# EAGLE design untitled (EAGLE 6.1)
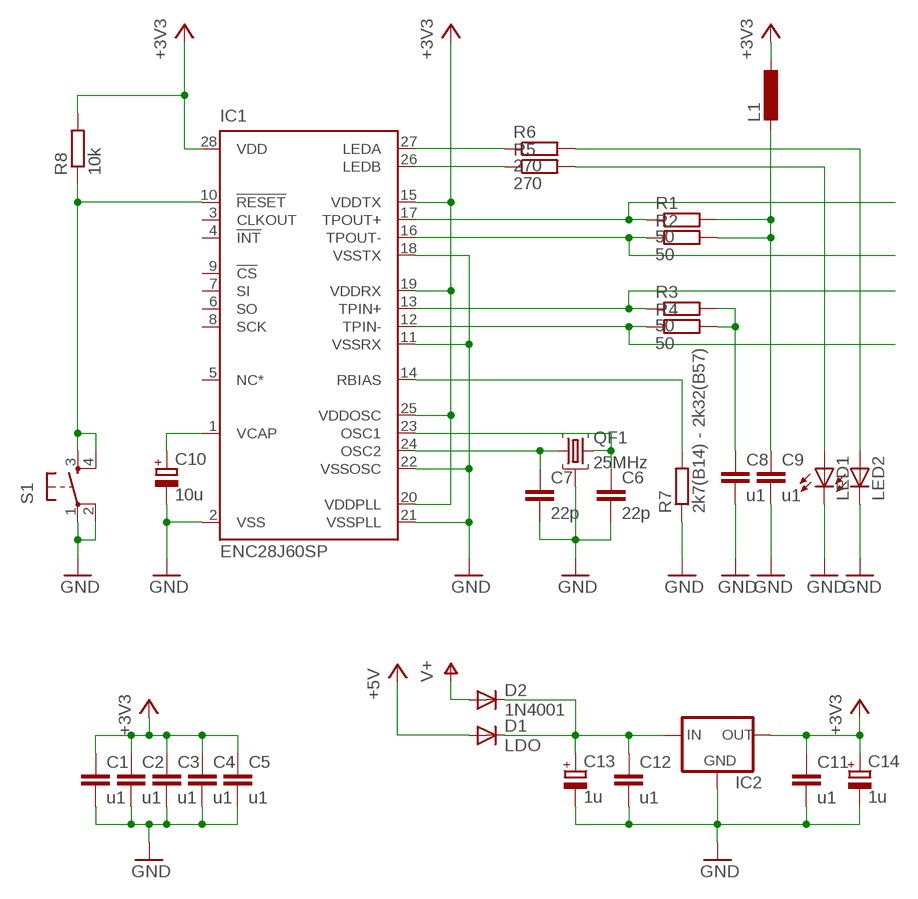
[diagram p0: schematic, sheet 1]

## Parts
C1  u1  C-EU025-025X050  [C025-025X050]
C2  u1  C-EU025-025X050  [C025-025X050]
C3  u1  C-EU025-025X050  [C025-025X050]
C4  u1  C-EU025-025X050  [C025-025X050]
C5  u1  C-EU025-025X050  [C025-025X050]
C6  22p  C-EU025-025X050  [C025-025X050]
C7  22p  C-EU025-025X050  [C025-025X050]
C8  u1  C-EU025-025X050  [C025-025X050]
C9  u1  C-EU025-025X050  [C025-025X050]
C10  10u  CPOL-EUE2.5-6  [E2,5-6]
C11  u1  C-EU025-025X050  [C025-025X050]
C12  u1  C-EU025-025X050  [C025-025X050]
C13  1u  CPOL-EUE2.5-6  [E2,5-6]
C14  1u  CPOL-EUE2.5-6  [E2,5-6]
D1  LDO  DIODE-D-2.5  [D-2.5]
D2  1N4001  DIODE-D-2.5  [D-2.5]
IC1  ENC28J60SP  [DIL28-3]
IC2  MCP1700_TO92-INLINE  [TO92-]
L1  L-EU0204/5  [0204/5]
LED1  LED5MM  [LED5MM]
LED2  LED5MM  [LED5MM]
QF1  25MHz  8M10AHC49T  [HC49U]
R1  50  R-EU_0204/7  [0204/7]
R2  50  R-EU_0204/7  [0204/7]
R3  50  R-EU_0204/7  [0204/7]
R4  50  R-EU_0204/7  [0204/7]
R5  270  R-EU_0204/7  [0204/7]
R6  270  R-EU_0204/7  [0204/7]
R7  2k7(B14) - 2k32(B57)  R-EU_0204/7  [0204/7]
R8  10k  R-EU_0204/2V  [0204V]
S1  TAC_SWITCHPTH  [TACTILE-PTH]

## Nets
+3V3: C1.1 C2.1 C3.1 C4.1 C5.1 C11.1 C14.+ IC1.15(VDDTX) IC1.19(VDDRX) IC1.20(VDDPLL) IC1.25(VDDOSC) IC1.28(VDD) IC2.3(OUT) L1.1 R8.2
+5V: D1.A
GND: C1.2 C2.2 C3.2 C4.2 C5.2 C6.2 C7.2 C8.2 C9.2 C10.- C11.2 C12.2 C13.- C14.- IC1.2(VSS) IC1.11(VSSRX) IC1.18(VSSTX) IC1.21(VSSPLL) IC1.22(VSSOSC) IC2.1(GND) LED1.K(C) LED2.K(C) QF1.2 R7.1 S1.1 S1.2
N$1: C10.+ IC1.1(VCAP)
N$2: C8.1 R3.2 R4.2
N$3: IC1.27(LEDA) R6.1
N$4: IC1.26(LEDB) R5.1
N$5: IC1.17(TPOUT+) R1.1
N$6: C7.1 IC1.24(OSC2) QF1.1
N$7: C6.1 IC1.23(OSC1) QF1.3
N$8: IC1.16(TPOUT-) R2.1
N$9: IC1.14(RBIAS) R7.2
N$10: IC1.13(TPIN+) R3.1
N$11: IC1.12(TPIN-) R4.1
N$12: LED1.A R5.2
N$13: C9.1 L1.2 R1.2 R2.2
N$14: LED2.A R6.2
N$15: C12.1 C13.+ D1.C D2.C IC2.2(IN)
N$17: IC1.10(!RESET) R8.1 S1.3 S1.4
V+: D2.A
Unconnected: IC1.3(CLKOUT) IC1.4(!INT) IC1.5(NC*) IC1.6(SO) IC1.7(SI) IC1.8(SCK) IC1.9(!CS)

## Library data of the parts
C1-C9 C11 C12 = rcl:C-EU: CAPACITOR, European symbol
C10 C13 C14 = rcl:CPOL-EU: POLARIZED CAPACITOR, European symbol
D1 D2 = diode:DIODE-: DIODE
IC1 = microchip:ENC28J60: Stand-Alone Ethernet Controller with SPI Interface Source: http://ww1.microchip.com/downloads/en/DeviceDoc/39662c.pdf; MF: MICROCHIP; MPN: ENC28J60/SP; OC_FARNELL: 1084619; OC_NEWARK: 96K3661
IC2 = _MY_OWN_LIB:MCP1700: VOLTAGE REGULATOR
L1 = rcl:L-EU: INDUCTOR, European symbol
LED1 LED2 = led:LED: LED OSRAM: - CHIPLED LG R971, LG N971, LY N971, LG Q971, LY Q971, LO R971, LY R971 LH N974, LH R974 LS Q976, LO Q976, LY Q976 LO Q996 - Hyper CHIPLED LW Q18S LB Q993, LB Q99A, LB R99A - SideLED LS A670, LO A670, LY A670, LG A670, LP A670 LB A673, LV A673, LT A673, LW A673 LH A674 LY A675 LS A676, LA A676, LO A676, LY A676, LW A676 LS A679, LY A679, LG A679 - Hyper Micro SIDELED® LS Y876, LA Y876, LO Y876, LY Y876 LT Y87S - SmartLED LW L88C, LW L88S LB L89C, LB L89S, LG L890 LS L89K, LO L89K, LY L89K LS L896, LA L896, LO L896, LY L896 - TOPLED LS T670, LO T670, LY T670, LG T670, LP T670 LSG T670, LSP T670, LSY T670, LOP T670, LYG T670 LG T671, LOG T671, LSG T671 LB T673, LV T673, LT T673, LW T673 LH T674 LS T676, LA T676, LO T676, LY T676, LB T676, LH T676, LSB T676, LW T676 LB T67C, LV T67C, LT T67C, LS T67K, LO T67K, LY T67K, LW E67C LS E67B, LA E67B, LO E67B, LY E67B, LB E67C, LV E67C, LT E67C LW T67C LS T679, LY T679, LG T679 LS T770, LO T770, LY T770, LG T770, LP T770 LB T773, LV T773, LT T773, LW T773 LH T774 LS E675, LA E675, LY E675, LS T675 LS T776, LA T776, LO T776, LY T776, LB T776 LHGB T686 LT T68C, LB T68C - Hyper Mini TOPLED® LB M676 - Mini TOPLED Santana® LG M470 LS M47K, LO M47K, LY M47K Source: http://www.osram.convergy.de LUXEON: - LUMILED® LXK2-PW12-R00, LXK2-PW12-S00, LXK2-PW14-U00, LXK2-PW14-V00 LXK2-PM12-R00, LXK2-PM12-S00, LXK2-PM14-U00 LXK2-PE12-Q00, LXK2-PE12-R00, LXK2-PE12-S00, LXK2-PE14-T00, LXK2-PE14-U00 LXK2-PB12-K00, LXK2-PB12-L00, LXK2-PB12-M00, LXK2-PB14-N00, LXK2-PB14-P00, LXK2-PB14-Q00 LXK2-PR12-L00, LXK2-PR12-M00, LXK2-PR14-Q00, LXK2-PR14-R00 LXK2-PD12-Q00, LXK2-PD12-R00, LXK2-PD12-S00 LXK2-PH12-R00, LXK2-PH12-S00 LXK2-PL12-P00, LXK2-PL12-Q00, LXK2-PL12-R00 Source: www.luxeon.com KINGBRIGHT: KA-3528ASYC Source: www.kingbright.com
QF1 = crystal:8M10AHC49T: Monolithic Crystal Filters Source: www.vanlong.com; OC_FARNELL: unknown; OC_NEWARK: unknown
R1-R8 = rcl:R-EU_: RESISTOR, European symbol
S1 = SparkFun:TAC_SWITCH: Momentary Switch Button commonly used for reset or general input. Spark Fun Electronics SKU : COM-00097

## Board
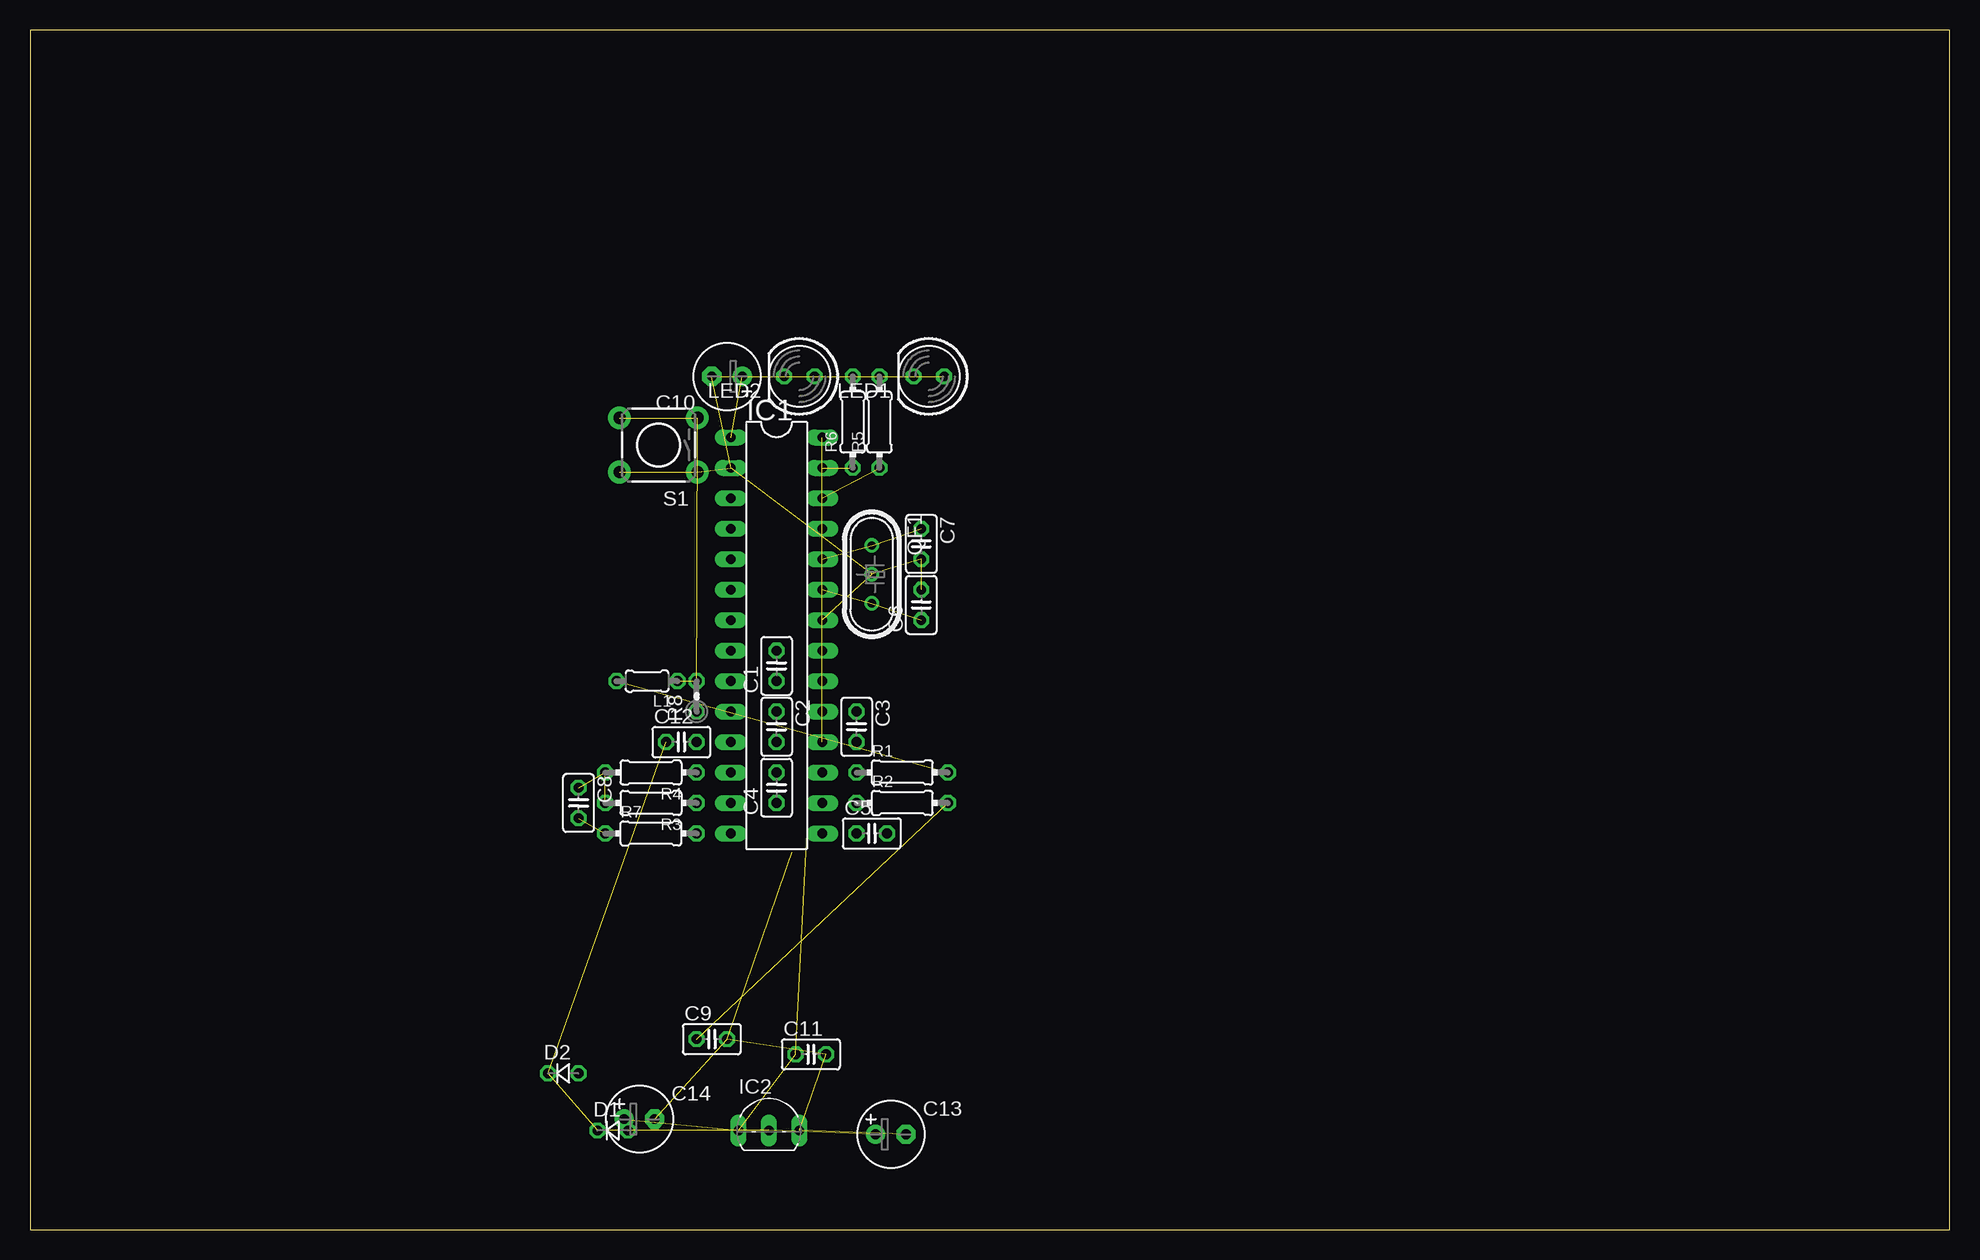
[diagram p1: board, top side]
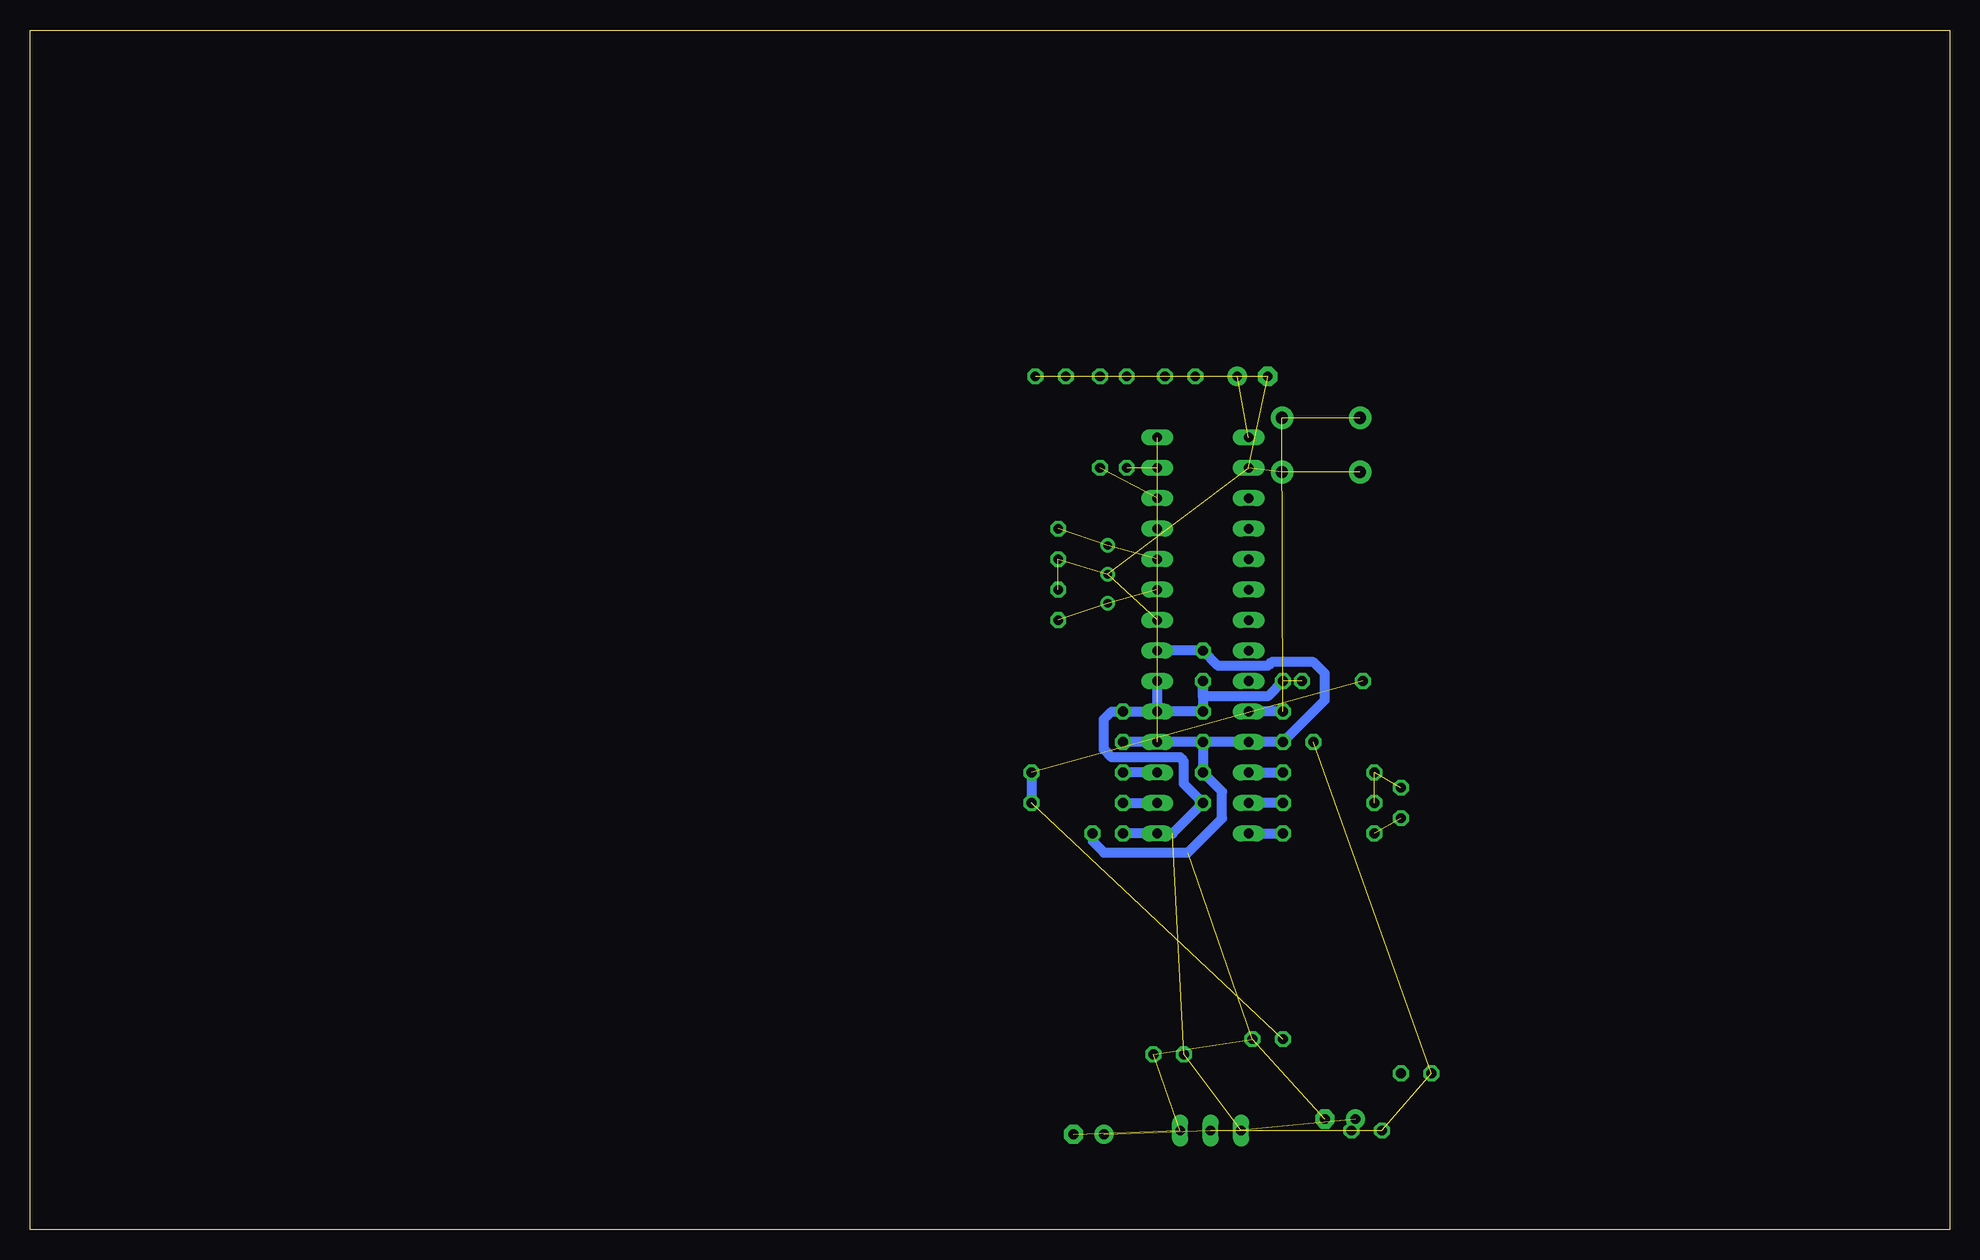
[diagram p2: board, bottom side, seen from below]

Size 160 x 100 mm. Coordinates in mm from the lower left corner, seen from the top.
Outline: 0,0 160,0 160,100 0,100 0,0
Copper layers (1*16): Top 0.035mm / dielectric 1.5mm / Bottom 0.035mm
Design rules: minimum track width 10mil, minimum drill 24mil, track to track 8mil, track to pad 8mil, pad to pad 8mil, via to via 8mil, smd to smd 8mil, copper to edge 40mil, drill to drill 8mil, minimum pad ring 10mil, minimum via ring 8mil, stop-mask expansion 4mil, vias tented up to drill 0mil, thermal gap 10mil

### Footprints (pad centres in the part's own frame; a part is rotated, then mirrored left to right if it is on the bottom)
C025-025X050 = drill 0.813 octagon: 1 -1.27,0; 2 1.27,0
E2,5-6 = drill 0.813 pad 1.6: + -1.27,0 | drill 0.813 pad 1.6 octagon: - 1.27,0
D-2.5 = drill 0.813 octagon: A 1.27,0; C -1.27,0
DIL28-3 = drill 0.813 long: 1 -16.51,-3.81; 2 -13.97,-3.81; 3 -11.43,-3.81; 4 -8.89,-3.81; 5 -6.35,-3.81; 6 -3.81,-3.81; 7 -1.27,-3.81; 8 1.27,-3.81; 9 3.81,-3.81; 10 6.35,-3.81; 11 8.89,-3.81; 12 11.43,-3.81; 13 13.97,-3.81; 14 16.51,-3.81; 15 16.51,3.81; 16 13.97,3.81; 17 11.43,3.81; 18 8.89,3.81; 19 6.35,3.81; 20 3.81,3.81; 21 1.27,3.81; 22 -1.27,3.81; 23 -3.81,3.81; 24 -6.35,3.81; 25 -8.89,3.81; 26 -11.43,3.81; 27 -13.97,3.81; 28 -16.51,3.81
TO92- = drill 0.813 long: 1 2.54,0; 2 0,0; 3 -2.54,0
0204/5 = drill 0.813 octagon: 1 -2.54,0; 2 2.54,0
LED5MM = drill 0.813 octagon: A -1.27,0; K 1.27,0
HC49U = drill 0.7 pad 1.2: 1 -2.413,0; 2 -0.027,0; 3 2.413,0
0204/7 = drill 0.813 octagon: 1 -3.81,0; 2 3.81,0
0204V = drill 0.813 octagon: 1 -1.27,0; 2 1.27,0
TACTILE-PTH = drill 1.016 pad 1.88: 1 -3.251,2.261; 2 3.251,2.261; 3 -3.251,-2.261; 4 3.251,-2.261

### Placement (x,y rotation side)
C1  62.23,46.99 90 top
C2  62.23,41.91 270 top
C3  68.9,41.91 270 top
C4  62.23,36.83 90 top
C5  70.17,33.02 0 top
C6  74.3,52.07 90 top
C7  74.3,57.15 270 top
C8  45.72,35.56 270 top
C9  56.83,15.88 0 top
C10  58.1,71.12 180 top
C11  65.09,14.61 0 top
C12  54.29,40.64 0 top
C13  71.75,7.94 0 top
C14  50.8,9.21 0 top
D1  48.58,8.26 0 top
D2  44.45,13.02 0 top
IC1  62.23,49.53 270 top
IC2  61.59,8.26 0 top
L1  51.44,45.72 180 top
LED1  74.93,71.12 180 top
LED2  64.14,71.12 180 top
QF1  70.17,54.61 270 top
R1  72.71,38.1 0 top
R2  72.71,35.56 0 top
R3  51.75,35.56 180 top
R4  51.75,38.1 180 top
R5  70.8,67.31 90 top
R6  68.58,67.31 90 top
R7  51.75,33.02 0 top
R8  55.56,44.45 90 top
S1  52.39,65.41 180 top

### Tracks (layer width: path | path; a pad name or v marks a point on that pad's centre or on a via)
+3V3  (6 unrouted)
  Bottom 0.813: C5.1 IC1.15 64.77,33.02 C4.1 63.82,37.15 63.82,39.05 64.14,39.37 69.85,39.37 70.48,40.01 70.48,42.55 69.85,43.18 C3.1 IC1.19 | IC1.19 C2.1 C1.1 62.23,44.45 56.83,44.45 R8.2 | IC1.19 IC1.20
GND  (17 unrouted)
  Bottom 0.813: C2.2 IC1.11 C12.2 52.07,44.13 52.07,46.35 53.02,47.31 56.52,47.31 56.83,46.99 60.96,46.99 C1.2 IC1.21 | C2.2 C4.2 60.64,36.51 60.64,34.29 63.5,31.43 70.48,31.43 71.44,32.38 C5.2 | C2.2 IC1.18 C3.2
N$1  (1 unrouted)
N$2  (2 unrouted)
N$3  (1 unrouted)
N$4  (1 unrouted)
N$5
  Bottom 0.813: IC1.17 R1.1
N$6  (2 unrouted)
N$7  (2 unrouted)
N$8
  Bottom 0.813: R2.1 IC1.16
N$9
  Bottom 0.813: IC1.14 R7.2
N$10
  Bottom 0.813: R3.1 IC1.13
N$11
  Bottom 0.813: IC1.12 R4.1
N$12  (1 unrouted)
N$13  (2 unrouted)
  Bottom 0.813: R1.2 R2.2
N$14  (1 unrouted)
N$15  (4 unrouted)
N$17  (2 unrouted)
  Bottom 0.813: R8.1 IC1.10